# Altium schematic sheet Buton.SchDoc
size A4
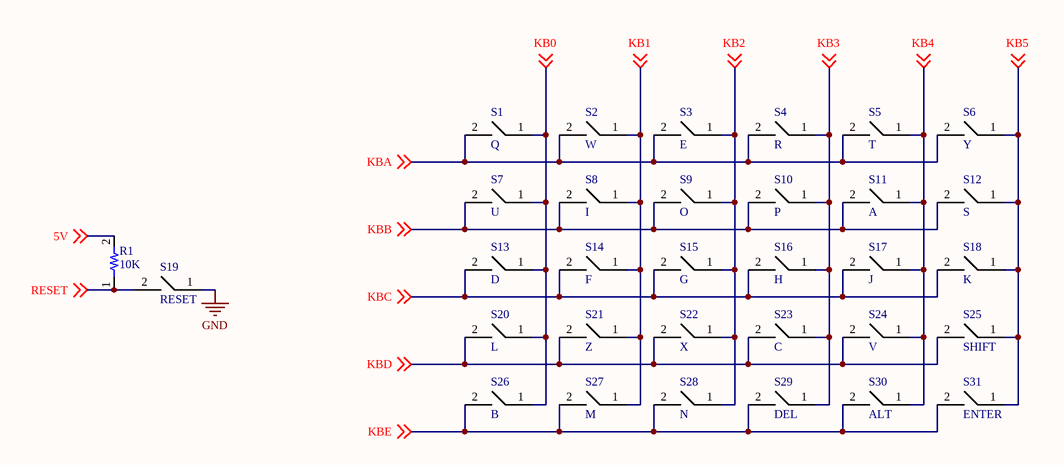
[diagram p0: Buton.SchDoc]

## Parts
R1  10K  [0603 Resistor]
S1  Q  [TACT SWITCH SMD]
S2  W  [TACT SWITCH SMD]
S3  E  [TACT SWITCH SMD]
S4  R  [TACT SWITCH SMD]
S5  T  [TACT SWITCH SMD]
S6  Y  [TACT SWITCH SMD]
S7  U  [TACT SWITCH SMD]
S8  I  [TACT SWITCH SMD]
S9  O  [TACT SWITCH SMD]
S10  P  [TACT SWITCH SMD]
S11  A  [TACT SWITCH SMD]
S12  S  [TACT SWITCH SMD]
S13  D  [TACT SWITCH SMD]
S14  F  [TACT SWITCH SMD]
S15  G  [TACT SWITCH SMD]
S16  H  [TACT SWITCH SMD]
S17  J  [TACT SWITCH SMD]
S18  K  [TACT SWITCH SMD]
S19  RESET  [TACT SWITCH SMD]
S20  L  [TACT SWITCH SMD]
S21  Z  [TACT SWITCH SMD]
S22  X  [TACT SWITCH SMD]
S23  C  [TACT SWITCH SMD]
S24  V  [TACT SWITCH SMD]
S25  SHIFT  [TACT SWITCH SMD]
S26  B  [TACT SWITCH SMD]
S27  M  [TACT SWITCH SMD]
S28  N  [TACT SWITCH SMD]
S29  DEL  [TACT SWITCH SMD]
S30  ALT  [TACT SWITCH SMD]
S31  ENTER  [TACT SWITCH SMD]

## Nets
GND: S19.1
5V: R1.2 ; off-sheet 5V
KB0: S1.1 S7.1 S13.1 S20.1 S26.1 ; off-sheet KB0
KB1: S2.1 S8.1 S14.1 S21.1 S27.1 ; off-sheet KB1
KB2: S3.1 S9.1 S15.1 S22.1 S28.1 ; off-sheet KB2
KB3: S4.1 S10.1 S16.1 S23.1 S29.1 ; off-sheet KB3
KB4: S5.1 S11.1 S17.1 S24.1 S30.1 ; off-sheet KB4
KB5: S6.1 S12.1 S18.1 S25.1 S31.1 ; off-sheet KB5
KBA: S1.2 S2.2 S3.2 S4.2 S5.2 S6.2 ; off-sheet KBA
KBB: S7.2 S8.2 S9.2 S10.2 S11.2 S12.2 ; off-sheet KBB
KBC: S13.2 S14.2 S15.2 S16.2 S17.2 S18.2 ; off-sheet KBC
KBD: S20.2 S21.2 S22.2 S23.2 S24.2 S25.2 ; off-sheet KBD
KBE: S26.2 S27.2 S28.2 S29.2 S30.2 S31.2 ; off-sheet KBE
RESET: R1.1 S19.2 ; off-sheet RESET

## Library data of the parts
R1 = 0603 Resistor: Resistor; Manufacturer_Name: TE Connectivity; Manufacturer_Part_Number: CPF0603B100RE1; Datasheet Link: http://www.farnell.com/datasheets/1786775.pdf; Height: 0.55mm; Mouser Part Number: 279-CPF0603B100RE1; Mouser Price/Stock: https://www.mouser.co.uk/ProductDetail/TE-Connectivity-Neohm/CPF0603B100RE1?qs=DfH2yQaBz6s2KWheq2AlNw%3D%3D; Arrow Part Number: CPF0603B100RE1; Arrow Price/Stock: https://www.arrow.com/en/products/cpf0603b100re1/te-connectivity
S1-S31 = TACT SWITCH SMD: MP: B3F-1000; MF: Omron; Price: None; Package: None; Value: *; Availability: Unavailable; SnapEDA_Link: https://www.snapeda.com/parts/B3F-1000/Omron%20Electronics%20Inc-EMC%20Div/view-part/48569/?ref=snap